# EAGLE board Mk3 v3.1415926535 (EAGLE 7.5.0), part 1 of 2
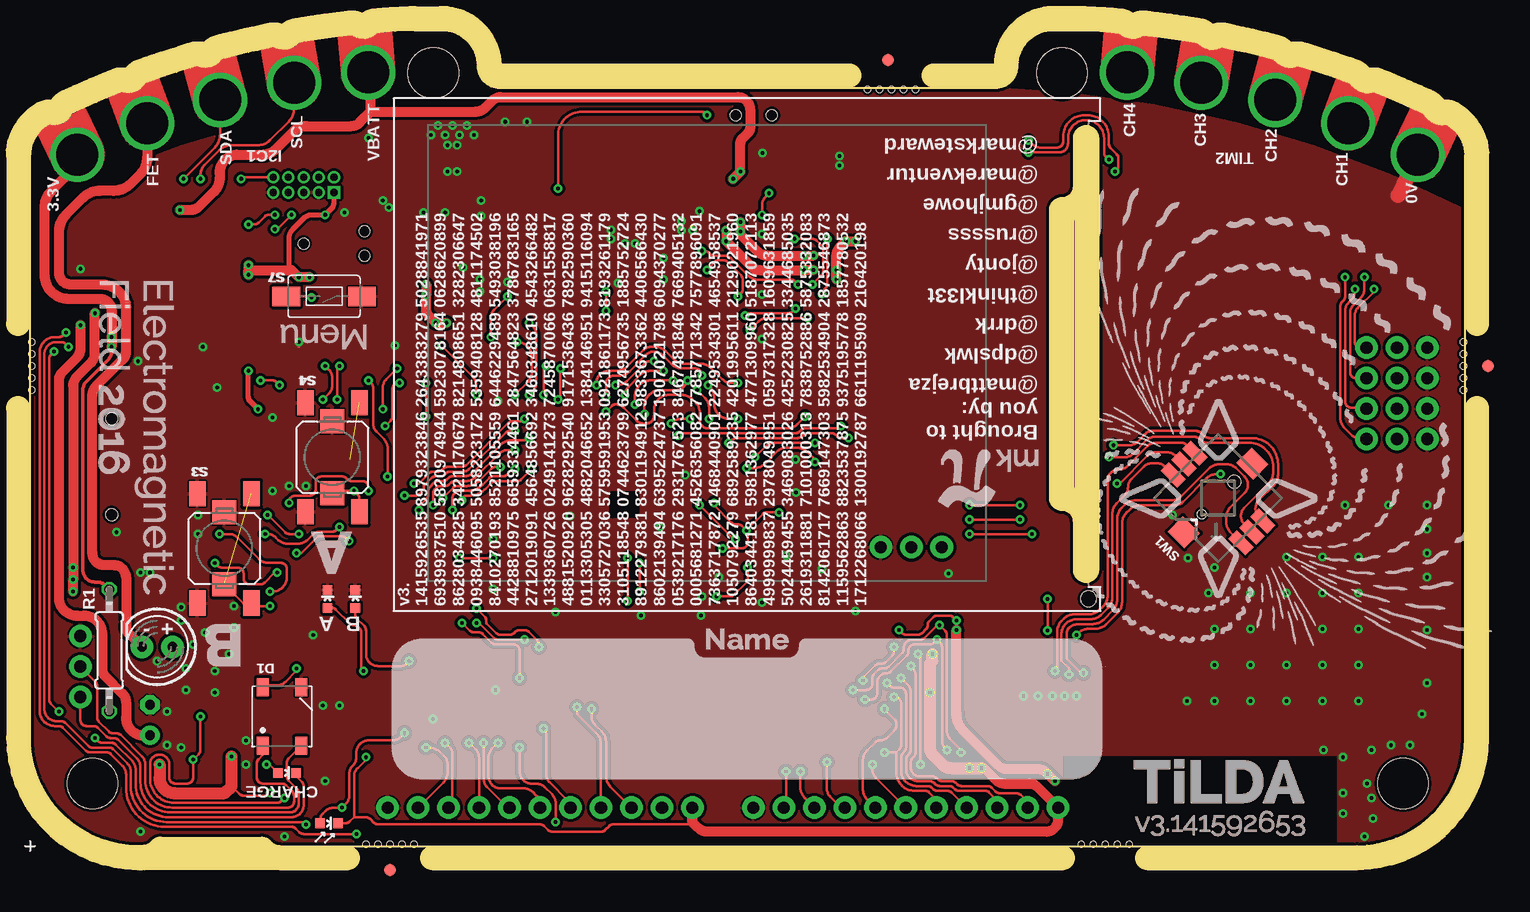
[diagram p2: board, top side]
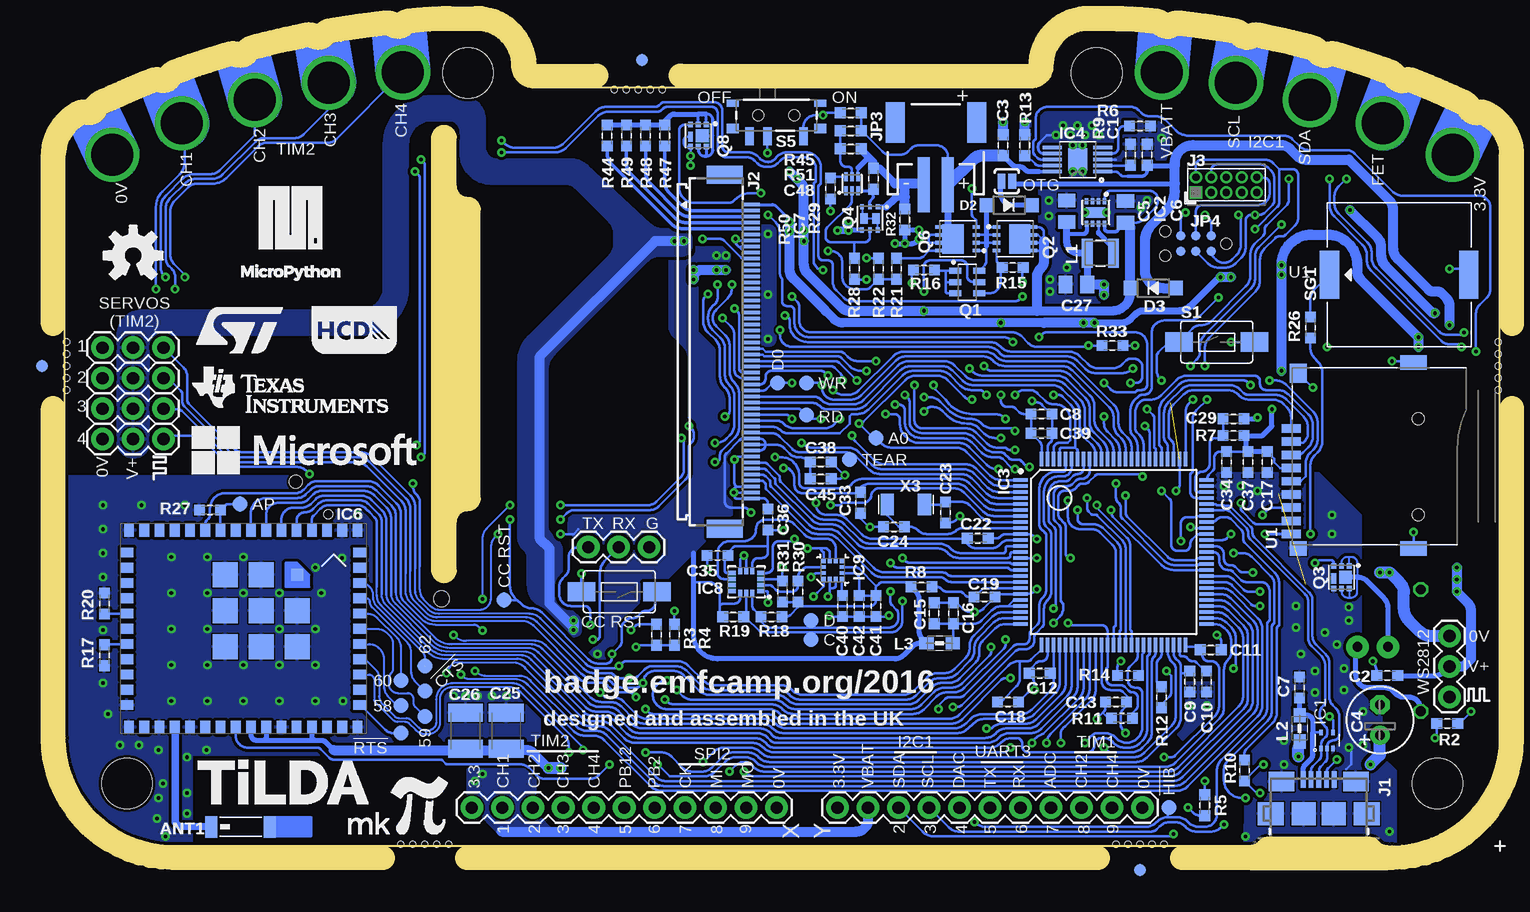
[diagram p3: board, bottom side, seen from below]

Size 119.6 x 68 mm. Coordinates in mm from the lower left corner, seen from the top.
Copper layers (1*16): Top 0.035mm / dielectric 1.4mm / Bottom 0.035mm
Design rules "TiLDA Mk3 DRC Rules": minimum track width 0.15mm, minimum drill 0.3mm, track to track 0.15mm, track to pad 0.15mm, pad to pad 0.15mm, via to via 0.15mm, smd to smd 0.05mm, copper to edge 0.2mm, drill to drill 11mil, minimum pad ring 8mil, minimum via ring 8mil, stop-mask expansion 0mil, vias tented up to drill 25mil, thermal gap 0.15mm
Net classes: 0 default: width 0.15 mm, drill 0.3 mm; 1 ANT: width 1.27 mm, drill 0.4 mm, clearance 0.4 mm; 2 90R: width 0.5 mm, drill 0.3 mm, clearance 0.7 mm to class 0, clearance 0.1 mm; 3 100R: width 0.15 mm, drill 0.3 mm, clearance 0.6 mm to class 2, clearance 0.4 mm; 4 5V0: width 0.406 mm, drill 0.3 mm, clearance 0.6 mm to class 2, clearance 0.6 mm to class 3; 5 3V3: width 0.254 mm, drill 0.3 mm, clearance 0.6 mm to class 2, clearance 0.6 mm to class 3; 6 1V8: width 0.254 mm, drill 0.3 mm, clearance 0.6 mm to class 2, clearance 0.6 mm to class 3; 7 H5V0: width 0.254 mm, drill 0.3 mm, clearance 0.6 mm to class 2, clearance 0.6 mm to class 3; 8 MAINS: clearance 4 mm to class 0, clearance 4 mm to class 1, clearance 4 mm to class 2, clearance 4 mm to class 3, clearance 4 mm to class 4, clearance 4 mm to class 5, clearance 4 mm to class 6, clearance 4 mm to class 7, clearance 4 mm

## Footprints (pad centres in the part's own frame; a part is rotated, then mirrored left to right if it is on the bottom)
2450AT42A100 = smd 1 x 1.8: P$1 -2.45,0; P$2 2.45,0
C0603K-SMALL = smd 0.889 x 0.889: 1 -0.875,0; 2 0.875,0
E2,5-6 = drill 0.813 pad 1.6: + -1.27,0 | drill 0.813 pad 1.6 octagon: - 1.27,0
C0805-N = smd 1.15 x 1.45: 1 -0.9,0; 2 0.9,0
C1210K = smd 1.5 x 2.9: 1 -1.5,0; 2 1.5,0
WS2812B = smd 1.5 x 1: 1 -2.45,1.6; 2 -2.45,-1.6; 3 2.45,-1.6; 4 2.45,1.6
SOD123 = smd 1.1 x 1.2: A 1.9,0; C -1.9,0
FIDUCIAL-1X2.5-STOP = smd 1 x 1: 1 0,0
DRL-5 = smd 0.3 x 0.45: 1 -0.5,-0.675; 2 0,-0.675; 3 0.5,-0.675; 4 0.5,0.675; 5 -0.5,0.675
WSON8 = smd 0.28 x 0.5: 1 -0.75,-0.95; 2 -0.25,-0.95; 3 0.25,-0.95; 4 0.75,-0.95; 5 0.75,0.95; 6 0.25,0.95; 7 -0.25,0.95; 8 -0.75,0.95 | smd 1.6 x 0.9: EP 0,0
TQFP100 = smd 0.3 x 1.2: 1 -6,-7.75; 2 -5.5,-7.75; 3 -5,-7.75; 4 -4.5,-7.75; 5 -4,-7.75; 6 -3.5,-7.75; 7 -3,-7.75; 8 -2.5,-7.75; 9 -2,-7.75; 10 -1.5,-7.75; 11 -1,-7.75; 12 -0.5,-7.75; 13 0,-7.75; 14 0.5,-7.75; 15 1,-7.75; 16 1.5,-7.75; 17 2,-7.75; 18 2.5,-7.75; 19 3,-7.75; 20 3.5,-7.75; 21 4,-7.75; 22 4.5,-7.75; 23 5,-7.75; 24 5.5,-7.75; 25 6,-7.75; 51 6,7.75; 52 5.5,7.75; 53 5,7.75; 54 4.5,7.75; 55 4,7.75; 56 3.5,7.75; 57 3,7.75; 58 2.5,7.75; 59 2,7.75; 60 1.5,7.75; 61 1,7.75; 62 0.5,7.75; 63 0,7.75; 64 -0.5,7.75; 65 -1,7.75; 66 -1.5,7.75; 67 -2,7.75; 68 -2.5,7.75; 69 -3,7.75; 70 -3.5,7.75; 71 -4,7.75; 72 -4.5,7.75; 73 -5,7.75; 74 -5.5,7.75; 75 -6,7.75 | smd 1.2 x 0.3: 26 7.75,-6; 27 7.75,-5.5; 28 7.75,-5; 29 7.75,-4.5; 30 7.75,-4; 31 7.75,-3.5; 32 7.75,-3; 33 7.75,-2.5; 34 7.75,-2; 35 7.75,-1.5; 36 7.75,-1; 37 7.75,-0.5; 38 7.75,0; 39 7.75,0.5; 40 7.75,1; 41 7.75,1.5; 42 7.75,2; 43 7.75,2.5; 44 7.75,3; 45 7.75,3.5; 46 7.75,4; 47 7.75,4.5; 48 7.75,5; 49 7.75,5.5; 50 7.75,6; 76 -7.75,6; 77 -7.75,5.5; 78 -7.75,5; 79 -7.75,4.5; 80 -7.75,4; 81 -7.75,3.5; 82 -7.75,3; 83 -7.75,2.5; 84 -7.75,2; 85 -7.75,1.5; 86 -7.75,1; 87 -7.75,0.5; 88 -7.75,0; 89 -7.75,-0.5; 90 -7.75,-1; 91 -7.75,-1.5; 92 -7.75,-2; 93 -7.75,-2.5; 94 -7.75,-3; 95 -7.75,-3.5; 96 -7.75,-4; 97 -7.75,-4.5; 98 -7.75,-5; 99 -7.75,-5.5; 100 -7.75,-6
HVSSOP10 = smd 0.3 x 1.6: 1 -1,-2.1; 2 -0.5,-2.1; 3 0,-2.1; 4 0.5,-2.1; 5 1,-2.1; 6 1,2.1; 7 0.5,2.1; 8 0,2.1; 9 -0.5,2.1; 10 -1,2.1 | smd 1.88 x 1.57: EP 0,0
CC3100MOD-LWK = smd 0.81 x 1.09: 1 -9.525,-8.2; 2 -8.255,-8.2; 3 -6.985,-8.2; 4 -5.715,-8.2; 5 -4.445,-8.2; 6 -3.175,-8.2; 7 -1.905,-8.2; 8 -0.635,-8.2; 9 0.635,-8.2; 10 1.905,-8.2; 11 3.175,-8.2; 12 4.445,-8.2; 13 5.715,-8.2; 14 6.985,-8.2; 15 8.255,-8.2; 16 9.525,-8.2; 28 9.525,8.2; 29 8.255,8.2; 30 6.985,8.2; 31 5.715,8.2; 32 4.445,8.2; 33 3.175,8.2; 34 1.905,8.2; 35 0.635,8.2; 36 -0.635,8.2; 37 -1.905,8.2; 38 -3.175,8.2; 39 -4.445,8.2; 40 -5.715,8.2; 41 -6.985,8.2; 42 -8.255,8.2; 43 -9.525,8.2 | smd 1.09 x 0.81: 17 9.7,-6.35; 18 9.7,-5.08; 19 9.7,-3.81; 20 9.7,-2.54; 21 9.7,-1.27; 22 9.7,0; 23 9.7,1.27; 24 9.7,2.54; 25 9.7,3.81; 26 9.7,5.08; 27 9.7,6.35; 44 -9.7,6.35; 45 -9.7,5.08; 46 -9.7,3.81; 47 -9.7,2.54; 48 -9.7,1.27; 49 -9.7,0; 50 -9.7,-1.27; 51 -9.7,-2.54; 52 -9.7,-3.81; 53 -9.7,-5.08; 54 -9.7,-6.35 | smd 1 x 1: 55 -4.5,-4.5 | smd 2.11 x 2.11: 56 -1.5,-4.5; 57 1.5,-4.5; 58 -4.5,-1.5; 59 -1.5,-1.5; 60 1.5,-1.5; 61 -4.5,1.5; 62 -1.5,1.5; 63 1.5,1.5
WSON-6 = smd 0.28 x 0.75: 1 -0.5,-0.575; 2 0,-0.575; 3 0.5,-0.575; 4 0.5,0.575; 5 0,0.575; 6 -0.5,0.575
LGA14 = smd 0.55 x 0.35: 1 -1.175,0.75; 2 -1.175,0.25; 3 -1.175,-0.25; 4 -1.175,-0.75; 8 1.175,-0.75; 9 1.175,-0.25; 10 1.175,0.25; 11 1.175,0.75 | smd 0.35 x 0.55: 5 -0.5,-0.925; 6 0,-0.925; 7 0.5,-0.925; 12 0.5,0.925; 13 0,0.925; 14 -0.5,0.925
LGA12 = smd 0.375 x 0.3: 1 -0.762,0.75; 4 -0.762,-0.75; 7 0.762,-0.75; 8 0.762,-0.25; 9 0.762,0.25; 10 0.762,0.75 | smd 0.375 x 0.35: 2 -0.762,0.25; 3 -0.762,-0.25 | smd 0.3 x 0.375: 5 -0.25,-0.762; 6 0.25,-0.762; 11 0.25,0.762; 12 -0.25,0.762
USB-AB-MICRO-SMD_LWK = smd 1.4 x 0.4: D+ 2.85,0; D- 2.85,0.65; GND 2.85,-1.3; ID 2.85,-0.65; VBUS 2.85,1.3 | smd 1.6 x 2.1: SHIELD 2.675,3.1; SHIELD@5 2.675,-3.1 | smd 1.9 x 2: SHIELD@0 0,1.25; SHIELD@1 0,-1.25 | smd 1.9 x 2.2: SHIELD@2 0,-4; SHIELD@3 0,4
FH12-50S-0.5SH = smd 0.3 x 1.3: 1 -12.25,3.25; 2 -11.75,3.25; 3 -11.25,3.25; 4 -10.75,3.25; 5 -10.25,3.25; 6 -9.75,3.25; 7 -9.25,3.25; 8 -8.75,3.25; 9 -8.25,3.25; 10 -7.75,3.25; 11 -7.25,3.25; 12 -6.75,3.25; 13 -6.25,3.25; 14 -5.75,3.25; 15 -5.25,3.25; 16 -4.75,3.25; 17 -4.25,3.25; 18 -3.75,3.25; 19 -3.25,3.25; 20 -2.75,3.25; 21 -2.25,3.25; 22 -1.75,3.25; 23 -1.25,3.25; 24 -0.75,3.25; 25 -0.25,3.25; 26 0.25,3.25; 27 0.75,3.25; 28 1.25,3.25; 29 1.75,3.25; 30 2.25,3.25; 31 2.75,3.25; 32 3.25,3.25; 33 3.75,3.25; 34 4.25,3.25; 35 4.75,3.25; 36 5.25,3.25; 37 5.75,3.25; 38 6.25,3.25; 39 6.75,3.25; 40 7.25,3.25; 41 7.75,3.25; 42 8.25,3.25; 43 8.75,3.25; 44 9.25,3.25; 45 9.75,3.25; 46 10.25,3.25; 47 10.75,3.25; 48 11.25,3.25; 49 11.75,3.25; 50 12.25,3.25 | smd 1.5 x 3: 51 -14.75,1; 52 14.75,1
PINHEAD_2X05_127 = drill 0.6 pad 1.016 square: 1 -2.54,-0.635 | drill 0.6 pad 1.016: 2 -2.54,0.635; 3 -1.27,-0.635; 4 -1.27,0.635; 5 0,-0.635; 6 0,0.635; 7 1.27,-0.635; 8 1.27,0.635; 9 2.54,-0.635; 10 2.54,0.635
1X11 = drill 1.016 pad 1.88: 1 0,0; 2 2.54,0; 3 5.08,0; 4 7.62,0; 5 10.16,0; 6 12.7,0; 7 15.24,0; 8 17.78,0; 9 20.32,0; 10 22.86,0; 11 25.4,0
JST-2-SMD = smd 1 x 4.6: 1 -1,-3.7; 2 1,-3.7 | smd 1.6 x 3.4: NC1 -3.4,1.5; NC2 3.4,1.5
TC2030-MCP-NL = smd 0.787 x 0.787: 1 1.27,-0.635; 2 1.27,0.635; 3 2.54,-0.635; 4 2.54,0.635; 5 3.81,-0.635; 6 3.81,0.635 | hole 0.889: 0,0; 5.08,-1.016; 5.08,1.016
1008 = smd 0.9 x 2.4: 1 -1.1,0; 2 1.1,0
WUERTH-0805 = smd 1.2 x 1: 1 -1.1,0; 2 1.1,0
LED5MM = drill 0.813 pad 1.88: A -1.27,0; K 1.27,0
LED-0603-CORRECT = smd 0.8 x 0.8: A 0.75,0; C -0.75,0
TILDA_MKπ_OUTLINE = drill 3.5: 3V3 3.944,57.614; CH1 91.417,64.462; CH2 97.598,63.614; CH3 103.762,62.167; CH4 109.842,60.229; FET 9.758,60.229; GND 115.656,57.614; SCL 22.002,63.614; SDA 15.838,62.167; VBATT 28.183,64.462 | hole 4.2: 33.6,64.4; 86,64.4; 5.2,5.2; 114.4,5.2 | hole 0.5: 32,0.15; 31,0.15; 30,0.15; 29,0.15; 28,0.15; 0.15,38; 0.15,39; 0.15,40; 0.15,41; 0.15,42; 69.8,63.05; 70.8,63.05; 71.8,63.05; 72.8,63.05; 73.8,63.05; 119.45,42; 119.45,41; 119.45,40; 119.45,39; 119.45,38; 91.6,0.15; 90.6,0.15; 89.6,0.15; 88.6,0.15; 87.6,0.15
SOT26 = smd 0.5 x 1: 1 -0.95,-1; 2 0,-1; 3 0.95,-1; 4 0.95,1; 5 0,1; 6 -0.95,1
Q3A = smd 0.3 x 0.6: 1 -0.975,-1.55; 2 -0.325,-1.55; 3 0.325,-1.55; 4 0.975,-1.55; 5 0.975,1.55; 6 0.325,1.55; 7 -0.325,1.55; 8 -0.975,1.55 | smd 2.45 x 1.775: EP 0,0.375
Q2 = smd 0.4 x 0.455: 1 -0.65,-0.922; 2 0,-0.922; 3 0.65,-0.922; 4 0.65,0.922; 5 0,0.922; 6 -0.65,0.922 | smd 1.05 x 1.1: EP1 -0.325,0 | smd 0.4 x 0.85: EP2 0.65,0.1
Q2_DUAL = smd 0.3 x 0.45: 1 -0.65,-0.975; 2 0,-0.975; 3 0.65,-0.975; 4 0.65,0.975; 5 0,0.975; 6 -0.65,0.975 | smd 0.625 x 0.9: EP1 -0.488,0; EP2 0.488,0
0207/10 = drill 0.813 octagon: 1 -5.08,0; 2 5.08,0
TACTILE-SWITCH-1101NE = smd 2.3 x 1.6: P$1 -3.15,0; P$2 3.15,0
SKPMAPE010-COMBINED = smd 2 x 2: 1 -3,0; 2 3,0 | smd 2.1 x 1.4: A1 -4.55,-2.25; A2 4.55,-2.25; B1 -4.55,2.25; B2 4.55,2.25
SWITCH-SPST-SMD-A = smd 0.7 x 1.5: 1 -2.25,-1.75; 2 -0.75,-1.75; 3 2.25,-1.75 | smd 1 x 0.6: GND1 -3.65,1; GND3 3.65,1 | smd 1 x 0.8: GND2 -3.65,-1.1; GND4 3.65,-1.1 | hole 0.9: -1.5,0; 1.5,0
BUZZER-PKLCS1212E = smd 1.6 x 4: P$1 -5.8,0; P$2 5.8,0
SJ_2S-NO = smd 0.635 x 1.27: 1 -0.45,0; 2 0.45,0
1X03 = drill 1.016 pad 1.88: 1 0,0; 2 2.54,0; 3 5.08,0
JOYSTICK_MULTICOMP_NOSILK = smd 2 x 1: A -4,1.275; B 4,1.275; C -4,-1.275; COM 4,0; CTR -4,0; D 4,-1.275 | smd 2 x 1.8: NC 0,4.05; NC@0 0,-4.05 | hole 0.75: 0,1.9 | hole 1.05: 0,-1.9
B1,27 = smd 1.27 x 1.27: TP 0,0
0011XAAX09X = smd 1.6 x 0.7: 1 -10.6,-0.8; 2 -10.6,-1.9; 3 -10.6,-3; 4 -10.6,-4.1; 5 -10.6,-5.2; 6 -10.6,-6.3; 7 -10.6,-7.4; 8 -10.6,-8.5; CD -10.6,-9.6 | smd 1.4 x 1.2: GND -10,-10.8 | smd 1.4 x 1.6: GND1 -10,3.8 | smd 2.2 x 1.2: GND2 -0.4,-10.8; GND3 -0.4,4.7 | hole 1: 0,0; 0,-8
ER-TFT024-3 = hole 1.3: 1,1
RESONATOR_EPSON_FC_145 = smd 1.1 x 1.8: P$1 -1.55,0; P$2 1.55,0

## Placement (x,y rotation side)
ANT1  2450AT42A100E  [2450AT42A100]  104.95,1.6 0 bottom
ARTWORK1  ARTWORK_MKπ_BACK  [TILDA_MKπ_ARTWORK_BACK]  0,0 0 bottom
ARTWORK2  ARTWORK_MKπ_FRONT  [TILDA_MKπ_ARTWORK_FRONT]  0,0 0 top
C1  0603/2u2/10V/X5R  [C0603K-SMALL]  29.4,57.6 270 bottom
C2  0603/1u/10V/X5R  [C0603K-SMALL]  9.4,14.2 0 bottom
C3  0603/2u2/10V/X5R  [C0603K-SMALL]  41.4,58.4 270 bottom
C4  DNP (OTG)  [E2,5-6]  10,10.5 90 bottom
C5  0805/10u/10V/X5R  [C0805-N]  36.1,52.9 90 bottom
C6  0805/10u/10V/X5R  [C0805-N]  31.2,52.85 90 bottom
C7  0603/100n/10V/X5R  [C0603K-SMALL]  16.7,13.2 270 bottom
C8  0603/4u7/10V/X5R  [C0603K-SMALL]  38.2,36 180 bottom
C9  DNP  [C0603K-SMALL]  25.85,13.7 90 bottom
C10  0603/0R  [C0603K-SMALL]  24.45,13.7 90 bottom
C11  0603/100n/10V/X5R  [C0603K-SMALL]  24.1,16.35 180 bottom
C12  0603/100n/10V/X5R  [C0603K-SMALL]  38.35,14.4 0 bottom
C13  0603/1u/10V/X5R  [C0603K-SMALL]  32,12 0 bottom
C15  0603/10n/25V/X7R  [C0603K-SMALL]  47.15,19.4 270 bottom
C16  0603/100n/10V/X5R  [C0603K-SMALL]  45.55,19.4 270 bottom
C17  0603/4u7/10V/X5R  [C0603K-SMALL]  19.4,32 90 bottom
C18  0603/1u/10V/X5R  [C0603K-SMALL]  41,12 180 bottom
C19  0603/0R  [C0603K-SMALL]  42.95,20.75 180 bottom
C22  0603/100n/10V/X5R  [C0603K-SMALL]  43.51,25.65 180 bottom
C23  0603/10p/50V/NP0  [C0603K-SMALL]  46.2,27.8 90 bottom
C24  0603/10p/50V/NP0  [C0603K-SMALL]  50.5,26.6 0 bottom
C25  1210/100u/20%  [C1210K]  82.8,9.6 90 bottom
C26  1210/100u/20%  [C1210K]  86.2,9.6 90 bottom
C27  0805/10u/10V/X5R  [C0805-N]  35.3,46.8 180 bottom
C29  0603/100n/10V/X5R  [C0603K-SMALL]  22.2,35.6 180 bottom
C33  0603/1u/10V/X5R  [C0603K-SMALL]  53.3,28.6 90 bottom
C34  0603/100n/10V/X5R  [C0603K-SMALL]  22.8,32 90 bottom
C35  0603/100n/10V/X5R  [C0603K-SMALL]  65.2,24.2 180 bottom
C36  0603/100n/10V/X5R  [C0603K-SMALL]  61,27.2 90 bottom
C37  0603/4u7/10V/X5R  [C0603K-SMALL]  21,32 90 bottom
C38  0603/4u7/10V/X5R  [C0603K-SMALL]  56.6,32 180 bottom
C39  0603/100n/10V/X5R  [C0603K-SMALL]  38.2,34.4 180 bottom
C40  0603/100n/10V/X5R  [C0603K-SMALL]  54.8,20 270 bottom
C41  0603/100n/10V/X5R  [C0603K-SMALL]  52,20 270 bottom
C42  0603/1u/10V/X5R  [C0603K-SMALL]  53.4,20 270 bottom
C45  0603/100n/10V/X5R  [C0603K-SMALL]  56.6,30.6 180 bottom
C48  DNP (0603/100n/10V/X5R)  [C0603K-SMALL]  54.1,58.1 180 bottom
D1  WS2812B  [WS2812B]  21,10.8 90 top
D2  NTS245SFT1G  [SOD123]  40.9,53.4 180 bottom
D3  NTS245SFT1G  [SOD123]  28.9,46.5 0 bottom
FID1  FIDUCIAL1X2.5-STOP  [FIDUCIAL-1X2.5-STOP]  71.5,65.5 90 top
FID2  FIDUCIAL1X2.5-STOP  [FIDUCIAL-1X2.5-STOP]  121.5,40 0 bottom
FID3  FIDUCIAL1X2.5-STOP  [FIDUCIAL-1X2.5-STOP]  30,-2 0 top
FID4  FIDUCIAL1X2.5-STOP  [FIDUCIAL-1X2.5-STOP]  30,-2 0 bottom
FID5  FIDUCIAL1X2.5-STOP  [FIDUCIAL-1X2.5-STOP]  121.5,40 0 top
FID6  FIDUCIAL1X2.5-STOP  [FIDUCIAL-1X2.5-STOP]  71.5,65.5 90 bottom
IC1  TPD3E001DRL  [DRL-5]  14.4,8.8 0 bottom
IC2  TPS62082  [WSON8]  33.7,52.8 180 bottom
IC3  STM32L475VG  [TQFP100]  32.2,24.5 270 bottom
IC4  BQ24092  [HVSSOP10]  35.2,57.2 90 bottom
IC6  CC3100MOD  [CC3100MOD-LWK]  104.72,18.1 180 bottom
IC7  DNP (BQ2970)  [WSON-6]  54,55.2 0 bottom
IC8  LSM6DS3  [LGA14]  62.8,22 180 bottom
IC9  LIS3MDL  [LGA12]  55.6,23 90 bottom
J1  ZX62-AB-5PA(11)  [USB-AB-MICRO-SMD_LWK]  15.1,2.7 90 bottom
J2  ER-CON50HT-1  [FH12-50S-0.5SH]  65.6,41.2 270 bottom
J3  2x5 1.27mm (NP)  [PINHEAD_2X05_127]  22.8,55.1 0 bottom
JP1  (NP)  [1X11]  85.68,3.2 0 bottom
JP2  (NP)  [1X11]  55.2,3.2 0 bottom
JP3  JST PH 2mm  [JST-2-SMD]  47,58.8 0 bottom
JP4  (NP)  [TC2030-MCP-NL]  22.8,50.2 180 bottom
L1  SRN2512-2R2M  [1008]  33.3,49.4 180 bottom
L2  BLM18KG121TN1D  [WUERTH-0805]  16.7,9.8 270 bottom
L3  BLM18KG121TN1D  [WUERTH-0805]  46.7,16.9 0 bottom
LED1  DNP  [LED5MM]  10.6,16.6 180 top
LED2  0603 RED  [LED-0603-CORRECT]  24.8,20.6 270 top
LED3  0603 GREEN  [LED-0603-CORRECT]  27.1,20.6 270 top
LED4  0603 RED  [LED-0603-CORRECT]  24.9,1.9 180 top
LED5  0603 RED  [LED-0603-CORRECT]  21.4,6.1 180 top
LOGO1  OSHW-LOGOM (NP)  [OSHW-LOGO-M]  113.9,49.2 0 bottom
LOGO2  LOGO_TI-4MM (NP)  [LOGO_TI_4MM]  109,36 0 bottom
LOGO3  LOGO_ST-4MM (NP)  [LOGO_ST_4MM]  109,41 0 bottom
LOGO4  LOGO_HCD-4MM (NP)  [LOGO_HDC_4MM]  99,41 0 bottom
LOGO5  LOGO_MICROSOFT-4MM (NP)  [LOGO_MS_4MM]  109,31 0 bottom
LOGO6  LOGO_MICROPYTHON-8MM (NP)  [LOGO_MICROPYTHON_8MM]  105,47 0 bottom
OUTLINE1  TILDA_MK3 (NP)  [TILDA_MKπ_OUTLINE]  0,0 0 top
Q1  DMMT5401  [SOT26]  44.4,47 270 bottom
Q2  CSD25402Q3A  [Q3A]  40.4,50.6 270 bottom
Q3  CSD13202Q2  [Q2]  13.2,22.4 180 bottom
Q4  DNP (CSD85301Q2)  [Q2_DUAL]  52.5,52.3 180 bottom
Q6  CSD25402Q3A  [Q3A]  45.2,50.6 90 bottom
Q8  CSD13202Q2  [Q2]  66.8,59.2 180 bottom
R1  DNP  [0207/10]  6.6,16.3 90 top
R2  0603/4k7/5%  [C0603K-SMALL]  4.4,10.2 180 bottom
R3  0603/220k/5%  [C0603K-SMALL]  70.3,17.6 270 bottom
R4  0603/220k/5%  [C0603K-SMALL]  68.8,17.6 90 bottom
R5  0603/4M7/5%  [C0603K-SMALL]  24.6,3.4 90 bottom
R6  0603/2k/5%  [C0603K-SMALL]  30,60 0 bottom
R7  0603/0R  [C0603K-SMALL]  22.2,34.2 180 bottom
R8  DNP  [C0603K-SMALL]  48.2,21.6 180 bottom
R9  0603/1k/5%  [C0603K-SMALL]  30.8,57.6 90 bottom
R10  0603/0R  [C0603K-SMALL]  21.3,6.3 270 bottom
R11  DNP  [C0603K-SMALL]  31.5,10.65 0 bottom
R12  0603/2k/5%  [C0603K-SMALL]  28.2,12.4 90 bottom
R13  0603/10k/5%  [C0603K-SMALL]  39.6,58.4 90 bottom
R14  0603/4k7/5%  [C0603K-SMALL]  31,14.2 0 bottom
R15  0603/47k/5%  [C0603K-SMALL]  40.6,48.2 0 bottom
R16  0603/10k/5%  [C0603K-SMALL]  48,48 180 bottom
R17  0603/10k/5%  [C0603K-SMALL]  116.3,15.9 270 bottom
R18  0603/4k7/5%  [C0603K-SMALL]  60.7,19.1 180 bottom
R19  0603/4k7/5%  [C0603K-SMALL]  63.9,19.1 0 bottom
R20  0603/220k/5%  [C0603K-SMALL]  116.3,20.2 90 bottom
R21  0603/470k/5%  [C0603K-SMALL]  50.3,48.1 90 bottom
R22  0603/470k/5%  [C0603K-SMALL]  51.8,48.1 90 bottom
R26  0603/120R/5%  [C0603K-SMALL]  15.8,43.2 270 bottom
R27  0603/220k/5%  [C0603K-SMALL]  107.5,28 180 bottom
R28  DNP (0603/4M7/5%)  [C0603K-SMALL]  53.8,48.1 270 bottom
R29  DNP (0603/4M7/5%)  [C0603K-SMALL]  52.2,55.6 90 bottom
R30  DNP (0603/10k/5%)  [C0603K-SMALL]  58.5,21.2 90 bottom
R31  DNP (0603/10k/5%)  [C0603K-SMALL]  59.8,21.2 90 bottom
R32  0603/0R  [C0603K-SMALL]  49.6,52.2 90 bottom
R33  0603/47k/5%  [C0603K-SMALL]  32.3,41.7 180 bottom
R44  0603/12R/5%  [C0603K-SMALL]  74.4,59.2 270 bottom
R45  0603/220k/5%  [C0603K-SMALL]  54.1,61.1 180 bottom
R47  0603/12R/5%  [C0603K-SMALL]  69.6,59.2 270 bottom
R48  0603/12R/5%  [C0603K-SMALL]  71.2,59.2 270 bottom
R49  0603/12R/5%  [C0603K-SMALL]  72.8,59.2 270 bottom
R50  DNP (0603/2k/5%)  [C0603K-SMALL]  55.8,54.8 270 bottom
R51  DNP (0603/330/5%)  [C0603K-SMALL]  54.1,59.6 0 bottom
S1  6x3  [TACTILE-SWITCH-1101NE]  23.6,42 0 bottom
S3  SKPMAPE010  [SKPMAPE010-COMBINED]  16.2,24.8 270 top
S4  SKPMAPE010  [SKPMAPE010-COMBINED]  25.2,32.4 270 top
S5  CUS-12TB  [SWITCH-SPST-SMD-A]  60.3,60.9 0 bottom
S7  6x3  [TACTILE-SWITCH-1101NE]  24.5,45.8 180 top
S8  DNP (6x3)  [TACTILE-SWITCH-1101NE]  73.4,21.2 180 bottom
SG1  BUZZER-PKLCS1212E  [BUZZER-PKLCS1212E]  8.4,47.6 0 bottom
SJ1  OTG (NP)  [SJ_2S-NO]  41.1,55.4 0 bottom
SV2  (NP)  [1X03]  4.2,17.5 270 bottom
SV3  (NP)  [1X03]  116.45,41.53 0 bottom
SV4  (NP)  [1X03]  116.45,33.91 0 bottom
SV5  (NP)  [1X03]  116.45,38.99 0 bottom
SV6  (NP)  [1X03]  116.45,36.45 0 bottom
SV7  (NP)  [1X03]  70.9,24.9 180 bottom
SW1  JOYSTICK  [JOYSTICK_MULTICOMP_NOSILK]  99,29 135 top
TP1  (NP)  [B1,27]  60.2,38.6 0 bottom
TP2  (NP)  [B1,27]  57.8,35.9 0 bottom
TP3  (NP)  [B1,27]  57.8,38.6 0 bottom
TP4  (NP)  [B1,27]  52,34 0 bottom
TP5  (NP)  [B1,27]  27.6,3.2 0 bottom
TP11  (NP)  [B1,27]  105,28.5 0 bottom
TP12  (NP)  [B1,27]  89.6,12.9 0 bottom
TP13  (NP)  [B1,27]  91.6,9.4 0 bottom
TP14  (NP)  [B1,27]  91.6,11.7 0 bottom
TP15  (NP)  [B1,27]  89.6,10.8 0 bottom
TP16  (NP)  [B1,27]  91.6,13.8 0 bottom
TP17  (NP)  [B1,27]  89.6,15 0 bottom
TP18  (NP)  [B1,27]  57.4,18.8 0 bottom
TP19  (NP)  [B1,27]  57.4,17.2 0 bottom
TP20  (NP)  [B1,27]  83,20.5 0 bottom
TP21  (NP)  [B1,27]  54.2,32.2 0 bottom
U1  USD-SOCKET  [0011XAAX09X]  6.8,35.6 0 bottom
U2  ER-TFT024-3 (NP)  [ER-TFT024-3]  89.2,19.6 90 top
X3  ABS07-32.768KHZ-T  [RESONATOR_EPSON_FC_145]  49.5,28.45 180 bottom

## Tracks (layer width: path | path; a pad name or v marks a point on that pad's centre or on a via)
!CC_HIB  (via drill 0.3)
  Top 0.2: v43.8,2 43.8,3.59 arc45 43.51,4.29 42.89,4.91 arc45 42.19,5.2 41.8,5.2 arc-90 40.8,6.2 v40.8,8.2
  Bottom 0.15: 81.03,15.23 arc-45 81.93,15.6 87.97,15.6 arc45 89.39,16.19 93.23,20.03 arc45 93.6,20.93 93.6,21.6
  Bottom 0.2: v40.8,8.2 41.05,7.95 arc45 41.41,7.8 60.47,7.8 arc45 61.37,8.17 61.43,8.23 arc-45 62.33,8.6 72.07,8.6 arc45 72.97,8.97 74.03,10.03 arc-45 74.93,10.4 75.67,10.4 arc45 76.57,10.77 81.03,15.23 | IC3.63 23.9,24.5 arc90 23.4,24 23.4,23.75 arc-90 22.65,23 22.61,23 arc45 22.25,22.85 21.55,22.15 arc-45 21.19,22 19.95,22 arc90 19.2,21.25 19.2,18.88 arc45 19.26,18.74 19.34,18.66 arc-45 19.4,18.52 19.4,11.53 arc45 19.77,10.63 23.23,7.17 arc-45 23.6,6.27 23.6,2.6 arc90 24.6,1.6 25.07,1.6 arc45 25.97,1.97 26.03,2.03 arc-45 26.93,2.4 27.67,2.4 | 27.67,2.4 arc-45 28.57,2.03 28.63,1.97 arc45 29.53,1.6 42.87,1.6 arc45 43.77,1.97 v43.8,2 | 93.6,21.6 93.6,26.92 arc-45 93.8,27.4 94.2,27.8 | 94.2,27.8 | 94.2,27.8 94.52,28.12 arc-45 95.2,28.4 97.59,28.4 arc-45 98.29,28.11 98.86,27.54 arc-45 99.01,27.18 IC6.4 | 94.2,27.8 | TP5.TP 27.67,3.2 27.67,2.4
!CC_RST  (via drill 0.3)
  Top 0.2: v74.2,6.8 74.2,15.59 arc45 74.05,15.95 v74,16 | v54,34.2 54.2,34.4 63.79,34.4 arc45 64.15,34.55 64.25,34.65 arc-45 64.61,34.8 67.19,34.8 arc45 67.55,34.95 v67.6,35 | v78.3,27.2 v82.5,27.2
  Bottom 0.2: IC6.35 105.36,9.2 arc-90 104.36,8.2 98.61,8.2 arc45 98.25,8.05 97.55,7.35 arc-45 97.19,7.2 88.28,7.2 arc45 88.14,7.14 87.86,6.86 arc-45 87.72,6.8 81.61,6.8 arc45 80.91,6.51 80.29,5.89 arc-45 79.59,5.6 75.81,5.6 arc-45 75.11,5.89 v74.2,6.8 | v67.6,35 67.35,34.75 arc45 67.2,34.39 67.2,34.01 arc45 67.35,33.65 67.45,33.55 arc-45 67.6,33.19 67.6,31.21 arc45 67.89,30.51 70.11,28.29 arc45 70.81,28 77.09,28 arc-45 77.79,27.71 v78.3,27.2 | IC3.2 41.67,30 arc45 42.57,30.37 43.63,31.43 arc-45 44.53,31.8 51.27,31.8 arc45 52.17,32.17 53.72,33.72 arc45 v54,34.2 | S8.P$1 70.4,21.05 70.4,20.21 arc45 70.55,19.85 70.65,19.75 arc45 71.01,19.6 71.19,19.6 arc-45 71.55,19.45 71.85,19.15 arc45 72.21,19 72.39,19 arc-45 72.75,18.85 73.05,18.55 arc-45 73.2,18.19 73.2,17.01 arc45 73.35,16.65 v74,16 74,15.7 arc90 74.5,15.2 75.07,15.2 arc45 75.97,15.57 79.86,19.46 arc-45 80.67,19.8 arc45 81.57,20.17 81.9,20.5 | 81.9,20.5 82.13,20.73 arc45 82.5,21.63 v82.5,27.2 | TP20.TP 81.9,20.5
!UART_CTS
  Bottom 0.15: 94.64,20.64 94.44,20.64 arc90 94.2,20.4 arc-45 93.99,19.89 91.12,17.02 arc45 90.75,16.12 90.75,14.58 arc-45 90.38,13.68 TP12.TP
  Bottom 0.2: IC6.51 94.64,20.64
!UART_RTS
  Bottom 0.2: IC6.44 94.95,11.75 92.89,9.69 arc-45 92.19,9.4 TP13.TP
+3V3  (via drill 0.3)
  Top 0.2: v41.6,37.6 41.91,37.91 arc45 42.2,38.61 42.2,42.59 arc45 41.91,43.29 v41.6,43.6 | 27,2.4 27,5.79 arc-45 27.29,6.49 28,7.2 v28,7.4 | 27,2.4 26.65,2.05 arc-45 26.29,1.9 LED4.C | 55.2,2.2 54.8,1.8 48.61,1.8 arc45 48.25,1.65 47.95,1.35 arc-45 47.59,1.2 43.51,1.2 arc-45 43.15,1.35 42.85,1.65 arc45 42.49,1.8 29.01,1.8 arc-45 28.65,1.95 28.35,2.25 arc45 27.99,2.4 27,2.4 | v57,28.6 57,28.4 58.45,26.95 arc45 58.81,26.8 58.99,26.8 arc-45 59.35,26.65 v59.7,26.3 | v62.4,27.8 61.41,27.8 arc45 61.05,27.65 v59.7,26.3 | v57.7,24.8 59.3,24.8 arc90 59.8,25.3 59.8,26.2 v59.7,26.3 | SW1.COM 95.49,32.51 arc45 94.79,32.8 93.81,32.8 arc45 93.11,32.51 90.8,30.2 v90.6,30.2 | v83.5,26 v78.3,26
  Top 0.305: v6.8,41.6 6.8,41.21 arc-45 6.51,40.51 4.69,38.69 arc45 4.4,37.99 4.4,23 arc90 5.4,22 5.61,22 arc-45 6.24,21.74 R1.2
  Top 0.406: J3.1 25.3,54.42 25.3,53.51 arc-45 25.15,53.15 v24.6,52.6 23.51,52.6 arc45 22.81,52.31 21.89,51.39 arc45 21.6,50.69 21.6,48 | v19,36.4 18.35,37.05 arc-45 18.2,37.41 v18.2,39.6
  Top 0.813: v65.3,49.2 61.41,49.2 arc-45 60.71,49.49 59.2,51 v59.2,51.2 v59.2,52 | v33,46.8 v33,45.9 33,44.81 arc45 33.29,44.11 v33.8,43.6 v34.7,43.6 | v18.2,47.6 18.2,48 | v79.3,6.5 79.5,6.5 80.51,5.49 arc45 81.21,5.2 83.27,5.2 arc-45 83.97,4.91 JP1.1 85.68,2.2 arc-90 84.68,1.2 56.41,1.2 arc-45 55.71,1.49 55.2,2 55.2,2.2 JP2.1 | OUTLINE1.3V3 3.94,56.57 3.77,56.57 1.79,54.59 arc45 1.2,53.17 1.2,47.6 arc90 3.2,45.6 5.8,45.6 arc-90 6.8,44.6 v6.8,42.4 v6.8,41.6 | v18.2,48.4 18.2,48 | 18.2,48 21.6,48 21.8,48 v22.4,47.4 v23.3,47.4
  Top 1: v75,12.8 75,15.2 75.2,15.4 v75.2,16
  Top 1.016: v75,12.8 75,8.21 arc45 75.29,7.51 76.01,6.79 arc45 76.71,6.5 v78.3,6.5 v79.3,6.5
  Bottom 0.15: v83.5,26 83.73,25.77 arc-45 84.1,24.87 84.1,20.65 arc90 85.1,19.65 88.27,19.65 arc45 89.17,20.02 89.63,20.48 arc45 90,21.38 90,23.33
  Bottom 0.2: v41.6,43.6 38,43.6 | 20.93,32.88 C37.2 C34.2 23.3,32.88 arc-90 23.8,32.38 23.8,31.61 arc45 23.95,31.25 24.25,30.95 arc-45 24.4,30.59 24.4,30.55 IC3.75 | v75,12.8 74.6,12.4 73.93,12.4 arc45 73.03,12.03 71.97,10.97 arc-45 71.07,10.6 61.33,10.6 arc45 60.43,10.23 60.37,10.17 arc-45 59.47,9.8 45.55,9.8 arc-45 44.49,10.24 44.16,10.56 arc45 43.1,11 39.93,11 arc-45 39.03,11.37 37.57,12.83 arc-45 37.2,13.73 37.2,14.4 | IC3.11 40.89,25.5 arc-45 41.59,25.21 41.71,25.09 arc45 42.41,24.8 43.59,24.8 arc45 44.29,25.09 44.4,25.2 44.4,25.64 C22.2 44.45,25.65 44.5,25.6 52.27,25.6 arc45 53.17,25.97 54.43,27.23 arc-45 55.33,27.6 56.12,27.6 arc45 56.8,27.9 arc45 57,28.52 v57,28.6 | IC3.100 38.2,33.32 arc-45 38.35,33.67 C39.2 C8.2 39.69,36 arc45 40.05,36.15 40.35,36.45 arc-45 40.71,36.6 41.1,36.6 arc90 41.6,37.1 v41.6,37.6 | v28,7.4 27.41,7.4 arc-45 27.05,7.55 23.77,10.83 arc-45 23.4,11.73 23.4,14.72 arc-45 23.6,15.2 23.65,15.25 arc-45 24.01,15.4 24.3,15.4 arc90 24.8,15.9 24.8,16.18 C11.2 25.15,16.35 25.4,16.6 26.05,16.6 IC3.50 | 61.2,33.45 arc-90 61.7,33.95 J2.40 63.04,33.95 arc-45 63.4,33.8 64.45,32.75 arc-45 64.6,32.39 64.6,28.7 arc-90 64.1,28.2 63.01,28.2 arc45 62.65,28.05 v62.4,27.8 | J2.42 61.7,32.95 arc-90 61.2,33.45 | J2.41 61.2,33.45 | JP4.1 24.07,51.86 arc-45 24.22,52.22 v24.6,52.6 | 61.2,33.45 60.36,33.45 arc45 59.66,33.16 59.19,32.69 arc-45 58.49,32.4 58.41,32.4 arc45 57.71,32.11 57.6,32 C38.2 C45.2 | IC9.9 55.85,24.47 arc-45 55.91,24.61 56.04,24.74 arc-45 56.18,24.8 56.7,24.8 | IC9.10 56.35,24.41 arc-45 56.38,24.48 56.7,24.8
  Bottom 0.2: 56.7,24.8 v57.7,24.8 | IC8.5 62.3,23.5 arc90 61.8,24 61.5,24 arc-90 61,24.5 61,25 | IC8.8 64.4,22.75 arc90 64.6,22.95 64.6,23.93 C35.1 64.33,24.48 63.95,24.85 arc45 63.59,25 61,25 | IC8.12 63.3,20.7 arc90 63.8,20.2 64.72,20.2 arc-45 64.86,20.14 65,20 | R19.1 65,19.1 65,20 | R8.2 49.2,21.6 49.6,22 51.39,22 arc-45 51.75,21.85 52,21.6 | 52,21.6 C41.1 | C41.1 52,20.5 arc90 52.5,20 58.17,20 R30.1 | R18.1 59.51,19.1 arc-45 59.15,19.25 58.5,19.9 R30.1 | 90,23.33 90,28.59 arc-45 90.29,29.29 90.31,29.31 arc45 90.6,30.01 v90.6,30.2 | v78.3,26 77.2,26 76.8,26.4 | U1.4 18.3,31.5 18.8,32 18.8,32.27 C17.2 | IC3.28 37.2,14.4 | C12.2 37.2,14.4 | 65,20 65,21 arc-90 66,22 67.2,22 | R31.1 R30.1 | 61,25 C36.1 61,26.3 v59.7,26.3 | IC9.5 53.9,22.75 arc90 53.4,22.25 C42.1 C41.1 | IC9.6 53.76,23.25 arc45 53.4,23.1 52,21.7 52,21.6 | C26.1 86.2,8 | C25.1 82.9,8.1 82.9,8
  Bottom 0.254: J2.1 60.66,53.45 arc45 60.3,53.3 59.35,52.35 arc45 v59.2,51.99
  Bottom 0.305: C37.2 21.05,32.88 21.12,32.95
  Bottom 0.341: IC2.5 34.45,51.25 arc90 34.7,51 36.1,51
  Bottom 0.406: IC6.36 104.09,9.3 arc-90 103.59,8.8 102.98,8.8 | 102.98,8.8 98.78,8.8 | 98.78,8.8 98.21,8.8 arc45 97.85,8.65 97.2,8 | IC6.37 102.82,8.96 102.98,8.8 | IC6.40 99.01,9.03 98.78,8.8 | 21.12,32.95 21.12,34 R7.1 19.8,34.2 19,35 v19,36.4 | R8.2 48.69,21.22 arc45 48.4,20.51 48.4,17.91 arc-45 48.11,17.21 L3.1 48.29,16.9 arc-45 48.99,16.61 49.71,15.89 arc45 50.41,15.6 65.2,15.6 arc90 67.2,17.6 67.2,22 67.2,24.4 | C17.2 C37.2
  Bottom 0.6: v33.8,43.6 31.51,43.6 arc-45 30.81,43.89 30.39,44.31 arc45 29.69,44.6 26.82,44.6 arc-45 25.76,45.04 23.4,47.4 v23.3,47.4 | C5.1 36.1,51 36.1,50.4 arc-90 35.1,49.4 L1.2 C27.1
  Bottom 0.75: 38,43.6 54.79,43.6 arc45 55.49,43.89 56.2,44.6
  Bottom 0.813: v33.8,43.6 v34.7,43.6 38,43.6 | 56.2,44.6 58.91,47.31 arc45 59.2,48.01 v59.2,51.2 v59.2,51.99 | 97.2,8 86.2,8 82.9,8 81.21,8 arc45 80.51,7.71 v79.3,6.5 | C27.1 v33,46.8 v33,45.9 | v22.4,47.4 v23.3,47.4 | v18.2,39.6 v18.2,47.6 v18.2,48.4 18.2,48.45 arc90 15.7,50.95 14.4,50.95 arc90 11.9,48.45 11.9,47.87 arc-45 11.64,47.24 v6.8,42.4 v6.8,41.6
  Bottom 1.016: v78.3,6.5 v79.3,6.5
  other vias: 64.5,49.2
  pour Bottom (isolate 0.254, rank 2): 66.9,48.5 64.7,48.5 arc-90 64.2,49 64.2,49.4 arc-90 64.7,49.9 68,49.9 arc-90 69.2,48.7 69.2,43.33 arc-45 68.83,42.43 67.97,41.57 arc45 67.6,40.67 67.6,34 68,33.6 68,30.8 70.4,28.4 70.4,28 77.2,28 77.6,27.6 77.6,26.2 77.1,25.7 74.7,25.7 74.7,17.3 76,16 76,15.9 75.6,15.4 74.7,15.4 73.2,16.4 73.2,18.8 70.4,21.6 70,21.6 64,27.6 64.4,40.4 66.9,42.9
ADC_IN  (via drill 0.3)
  Top 0.2: JP2.8 37.42,7.37 arc45 37.13,8.07 v36.6,8.6
  Bottom 0.2: v36.6,8.6 36.6,9.47 arc45 36.23,9.97 34.07,12.13 arc-45 33.7,13.03 IC3.35
ADC_LIGHT  (via drill 0.3)
  Top 0.2: v31.2,9.4 30.89,9.09 arc-45 30.19,8.8 28.2,8.8 arc90 27.2,7.8 27.2,7.41 arc-45 26.91,6.71 26.89,6.69 arc45 26.6,5.99 26.6,4.21 arc-45 26.31,3.51 v26,3.2 25.31,3.2 arc45 24.61,2.91 24.44,2.74 arc45 24.15,2.04 LED4.A
  Bottom 0.2: IC3.36 33.2,13.75 arc-90 32.45,13 31.81,13 arc45 31.45,12.85 30.9,12.3 31.12,12.07 C13.2 31.2,11.93 31.2,11.6 31.45,11.35 arc-45 31.6,10.99 31.6,10.08 | v31.2,9.4 arc45 31.46,9.74 arc45 31.6,10.08 | 31.6,10 31.6,10.08 | R5.1 24.91,2.52 arc45 25.62,2.82 v26,3.2
ADC_VIN  (via drill 0.3)
  Top 0.2: v69.4,13.8 arc-45 69.54,14.14 70.45,15.05 arc-45 70.81,15.2 70.99,15.2 arc45 71.35,15.35 71.85,15.85 arc45 72,16.21 v72,16.6
  Bottom 0.2: IC3.26 38.2,16.4 39.05,15.55 arc45 39.41,15.4 40,15.4 | 40,15.4 40.07,15.4 arc-45 40.97,15.03 45.03,10.97 arc45 45.93,10.6 59.07,10.6 arc45 59.97,10.97 60.03,11.03 arc-45 60.93,11.4 69.4,11.4 arc90 70.6,12.6 arc90 v69.4,13.8 | 40,15.4 40,14.01 arc45 40.29,13.31 41.41,12.19 arc45 C18.2 | R4.1 R3.2 71.88,16.73 v72,16.6
ADC_X
  Bottom 0.2: J2.46 61.56,30.95 arc45 61.2,30.8 60.86,30.46 arc45 60.8,30.32 60.8,30.08 arc-45 60.74,29.94 57.57,26.77 arc-45 56.67,26.4 55.93,26.4 arc45 55.03,26.03 52.17,23.17 arc-45 51.27,22.8 46.48,22.8 arc45 46,22.6 arc-45 45.76,22.5 IC3.17
ADC_Y
  Bottom 0.2: J2.47 61.53,30.45 arc45 61.39,30.39 61.26,30.26 arc45 61.2,30.12 61.2,29.88 arc-45 61.14,29.74 57.77,26.37 arc-45 56.87,26 56.13,26 arc45 55.23,25.63 52.37,22.77 arc-45 51.47,22.4 46.68,22.4 arc45 46.2,22.2 arc-45 45.72,22 IC3.18
BAT
  Bottom 0.2: IC7.5 54,56.3 arc-90 54.3,56.6 54.48,56.6 arc90 54.98,57.1 C48.2 R51.1
BOOT0/JOY_CEN  (via drill 0.3)
  Top 0.2: v37.2,37.6 37.2,38.39 arc45 36.91,39.09 v34.3,41.7 | v89.9,57.2 89.62,57.48 arc-45 89.5,57.77 89.5,59 arc90 88,60.5 arc90 86.5,59 86.5,58.55 arc-90 85.75,57.8 v83.2,57.8 | v56.4,48 57.05,48.65 arc-45 57.41,48.8 57.79,48.8 arc-45 58.15,48.65 59.25,47.55 arc-45 59.4,47.19 59.4,46.41 arc-45 59.25,46.05 v59,45.8 | v89.9,32.4 91.21,32.4 arc45 91.92,32.69 93.03,33.81 arc-45 93.74,34.1 97.01,34.1 arc-45 97.5,33.9 97.59,33.8 arc45 98.09,33.6 101.6,33.6 arc-90 103.6,31.6 103.6,31.13 arc-45 103.23,30.23 101.21,28.21 arc90 101.21,26.79 SW1.CTR
  Bottom 0.2: IC3.97 36.7,33 arc90 36.5,33.2 35.4,33.2 | IC3.94 35.2,32.92 arc-45 35.26,33.06 35.4,33.2 | 35.4,33.2 35.4,35.87 arc-45 35.77,36.77 36.45,37.45 arc-45 36.81,37.6 v37.2,37.6 | v89.9,32.4 89.72,32.58 arc-45 89.6,32.87 89.6,56.73 arc-45 89.72,57.02 v89.9,57.2 | v56.4,48 arc90 57.2,48.8 57.2,55.12 arc45 57.14,55.26 57.06,55.34 arc-45 57,55.48 57,56.4 arc-90 58,57.4 59.29,57.4 arc-45 59.99,57.11 60.21,56.89 arc45 60.91,56.6 61.19,56.6 arc45 61.89,56.89 62.11,57.11 arc-45 62.81,57.4 64.45,57.4 arc90 65.2,58.15 65.2,61.1 arc-90 65.7,61.6 69.39,61.6 arc-45 69.75,61.45 69.85,61.35 arc45 70.21,61.2 74.28,61.2 arc-45 75.17,60.83 77.83,58.17 arc45 78.72,57.8 v83.2,57.8 | v59,45.8 58.55,45.35 arc45 58.4,44.99 58.4,43.8 arc-90 57.4,42.8 40.61,42.8 arc45 39.91,42.51 39.29,41.89 arc-45 38.59,41.6 34.4,41.6 v34.3,41.7 R33.2
BTN_A  (via drill 0.3)  (1 unrouted)
  Top 0.2: S4.2 25.2,29.6 v27,29.6 27.3,29.3 arc-45 27.45,28.94 S4.B2 27.6,27.7 | 27.6,27.7 27.6,28.8 | 27.6,27.57 27.6,27.7
  Bottom 0.2: IC3.77 26.7,30.11 arc45 26.85,29.75 v27,29.6
BTN_B  (via drill 0.3)  (1 unrouted)
  Top 0.2: v20,20 18.7,20 S3.B2 17.75,20.25 S3.2
  Bottom 0.2: IC3.58 23.01,22 arc45 22.31,21.71 20.75,20.15 arc-45 20.39,20 v20,20
BTN_MENU  (via drill 0.3)
  Top 0.2: S7.P$2 23.37,45.8 v23.47,45.7
  Bottom 0.2: IC3.84 30.2,33.27 arc-45 30.57,34.17 arc45 30.8,34.72 30.8,36.27 arc45 30.43,37.17 30.15,37.45 arc45 29.79,37.6 29.7,37.6 arc-90 29,38.3 29,42.92 arc45 28.8,43.4 28.77,43.43 arc45 27.87,43.8 25.9,43.8 arc-45 25,44.17 v23.47,45.7 23.57,45.6
BUZZ  (via drill 0.3)
  Top 0.2: v15.8,26 16.59,26 arc-45 17.29,25.71 19.11,23.89 arc45 19.81,23.6 20.9,23.6 arc-90 21.4,23.1 21.4,22.4 arc-90 20.2,21.2 v20,21.2
  Bottom 0.2: v15.8,26 15.8,31.67 arc45 15.43,32.57 15.17,32.83 arc-45 14.8,33.73 14.8,39.47 arc-45 15.17,40.37 15.43,40.63 arc45 15.8,41.53 R26.2 15.8,41.4 | IC3.59 22.91,22.5 arc45 22.21,22.21 21.35,21.35 arc-45 20.99,21.2 v20,21.2
C1
  Bottom 0.2: C40.1 54.85,20.88 IC9.4
CC_IRQ  (via drill 0.3)
  Top 0.2: v84.8,17.95 v84.8,20.6 | v78.3,28.4 v82.5,28.4 | v58.2,33.6 58.31,33.71 arc-45 59.01,34 63.99,34 arc45 64.35,34.15 64.45,34.25 arc-45 64.81,34.4 66.79,34.4 arc-45 67.15,34.25 67.25,34.15 arc45 67.61,34 v68.2,34
  Bottom 0.15: v84.8,17.95 85.15,18.3 arc-45 85.51,18.45 88.72,18.45 arc45 89.77,18.82 91.23,20.28 arc45 91.6,21.03 | v82.5,28.4 84.43,26.47 arc-45 84.8,25.57 v84.8,20.6
  Bottom 0.2: v68.2,34 arc45 68,33.52 68,31.41 arc45 68.29,30.71 70.31,28.69 arc45 71.01,28.4 v78.3,28.4 | IC3.3 41.77,29.5 arc45 42.67,29.87 43.83,31.03 arc-45 44.73,31.4 51.47,31.4 arc45 52.37,31.77 53.43,32.83 arc-45 54.33,33.2 57.39,33.2 arc45 58.09,33.49 v58.2,33.6 | IC6.11 107.9,26.79 arc45 107.75,27.15 107.65,27.25 arc-45 107.5,27.61 107.5,27.78 107.5,28.13 arc90 106.23,29.4 100.41,29.4 arc-45 99.71,29.69 99.29,30.11 arc45 98.59,30.4 94.33,30.4 arc45 93.43,30.03 91.97,28.57 arc45 91.6,27.67 91.6,21.03
CC_RESERVED
  Bottom 0.2: IC6.21 116.3,19.37 R20.1
COUT
  Bottom 0.2: Q4.5 52.5,50.8 arc90 53,50.3 53.8,50.3 | IC7.2 54,53.81 arc45 54.15,53.45 56.05,51.55 arc-45 56.2,51.19 56.2,50.8 arc-90 55.7,50.3 53.8,50.3 | R28.1 53.8,50.3
D_N
  Bottom 0.2: J1.D- 15.75,6.29 arc45 15.6,6.64 15.05,7.2 arc-45 14.9,7.55 IC1.1 14.9,8.49 arc45 14.75,8.85 14.55,9.05 arc-45 14.4,9.41 14.4,9.59 arc-45 14.55,9.95 14.71,10.11 arc45 15,10.81 15,11.19 arc45 14.85,11.55 14.72,11.68 arc-45 14.57,12.03 14.57,15.11 arc-45 14.87,15.82 15.68,16.64 arc45 15.97,17.34 15.97,20.31 arc-45 16.27,21.02 20.83,25.58 arc45 20.98,25.93 20.98,26.12 arc-45 21.12,26.47 22.53,27.88 arc-45 22.88,28.02 23,28.02 23.02,28 IC3.70
D_P
  Bottom 0.2: IC3.71 23.7,28.5 23.6,28.4 23.02,28.4 23,28.38 22.73,28.38 arc45 22.38,28.23 20.77,26.62 arc45 20.62,26.27 20.62,26.08 arc-45 20.48,25.73 15.92,21.16 arc45 15.62,20.46 15.62,17.49 arc-45 15.33,16.78 14.52,15.96 arc45 14.22,15.26 14.22,12.44 arc-45 13.93,11.73 13.69,11.49 arc45 13.4,10.79 13.4,9.3 arc90 13.9,8.8 arc-90 14.4,8.3 IC1.2 14.4,7.36 arc45 14.55,7.01 14.93,6.62 arc-45 15.08,6.27 15.08,6.17 15.1,6.15 J1.D+
DAC_OUT  (via drill 0.3)
  Top 0.2: JP2.5 arc45 44.78,3.81 43.29,5.31 arc-45 43,6.01 43,9.39 arc45 42.85,9.75 v42.8,9.8
  Bottom 0.2: IC3.30 36.2,13.53 arc45 36.57,12.63 38.63,10.57 arc45 39.53,10.2 41.47,10.2 arc-45 42.37,9.83 arc45 42.44,9.8 v42.8,9.8
DFGFDG
  Bottom 0.2: IC3.22 41,20 | IC3.21 40.5,20.5 41,20 | 45.58,18.52 C16.2 43.86,18.52 arc-45 43.2,18.8 42.37,19.63 arc45 41.47,20 41,20 | C15.2 45.58,18.52 | 45.58,18.52 45.58,16.9 L3.2 45.7,16.9
DOUT
  Bottom 0.2: R29.1 52.2,54.62
  Bottom 0.254: IC7.3 52.23,54.62 | 52.2,54.62 52.23,54.62 | Q4.2 52.5,53.67 arc45 52.44,53.81 52.28,53.97 arc-45 52.23,54.11 52.23,54.62
DRDY
  Bottom 0.2: IC8.9 64.7,22.25 arc90 65.2,22.75 65.2,24.4 arc90 64.2,25.4 63,25.4 arc-90 62,26.4 arc90 61.2,27.2 59.73,27.2 arc45 58.83,26.83 57.97,25.97 arc-45 57.07,25.6 56.08,25.6 arc45 55.6,25.4 arc45 55.35,24.8 IC9.8
FET_OUT
  Top 0.813: OUTLINE1.FET 9.76,57.39 arc-45 9.17,55.97 8.39,55.19 arc-45 6.97,54.6 5.83,54.6 arc45 4.41,54.01 2.99,52.59 arc45 2.4,51.17 2.4,47.8 arc90 3.4,46.8 6,46.8 arc-90 8,44.8 8,41.21 arc-45 7.71,40.51 5.49,38.29 arc45 5.2,37.59 5.2,24.4 arc90 6.2,23.4 7,23.4 arc-90 8,22.4 8,18.34 arc45 8.29,17.64 LED1.K
  Bottom 0.15: Q3.5 13.2,21.2 arc-90 12.7,20.7 12.6,20.7 | 12.6,20.7 12.4,20.7 arc-90 11.9,21.2 11.9,22.37 11.93,22.4 11.9,22.43 11.9,23.6 arc-90 12.4,24.1 12.55,24.1 | Q3.6 12.55,20.75 12.6,20.7 | Q3.2 13.2,23.6 arc90 12.7,24.1 12.55,24.1 | Q3.1 12.55,24.1
  Bottom 0.406: LED1.K 9.33,19.8 arc-45 9.7,20.7 11.03,22.03 arc-45 11.93,22.4 Q3.EP1
FORCE_AP
  Bottom 0.2: IC6.10 R27.1 106.27,28.35 arc45 105.92,28.5 TP11.TP
FS_VUSB
  Bottom 0.2: IC3.68 24.01,27 arc-45 23.65,27.15 23.55,27.25 arc45 23.19,27.4 22.81,27.4 arc45 22.45,27.25 21.55,26.35 arc45 21.4,25.99 21.4,25.61 arc-45 21.25,25.25 18.77,22.77 arc45 18.4,21.88 18.4,18.48 arc45 18.46,18.34 18.54,18.26 arc-45 18.6,18.12 18.6,11.13 arc45 18.97,10.23 21.15,8.05 arc-45 21.3,7.69 R10.1
FSMC_A23  (via drill 0.3)
  Top 0.2: v53.4,35.2 53.43,35.23 arc-45 54.33,35.6 v55,35.6 | v44,37.2 44.2,37.4 v44.2,39.8
  Bottom 0.2: IC3.1 41.57,30.5 arc45 42.47,30.87 44.43,32.83 arc-45 45.33,33.2 50.67,33.2 arc45 51.57,33.57 TP4.TP arc45 52.34,34.14 v53.4,35.2 arc-45 53.06,35.34 49.57,38.83 arc45 48.67,39.2 46.93,39.2 arc45 46.03,38.83 44.68,37.48 arc-45 v44,37.2 | IC3.89 32.7,32.77 arc-45 33.07,33.67 33.83,34.43 arc45 34.2,35.33 34.2,36.47 arc-45 34.57,37.37 36.03,38.83 arc-45 36.93,39.2 43.07,39.2 arc45 43.97,39.57 v44.2,39.8 | v55,35.6 55.43,35.17 arc45 56.33,34.8 58.77,34.8 arc45 59.67,35.17 59.7,35.2 arc-45 60.3,35.45 J2.37
GND  (via drill 0.3)
  Top 0.2: v22.4,42 22.4,41.6
  Top 1.27: OUTLINE1.GND 114,54.2
  Bottom 0.2: C22.1 41.96,25.65 arc-45 41.61,25.79 41.55,25.85 arc45 41.19,26 IC3.10 39.41,26 arc45 38.71,25.71 v38.6,25.6 | IC3.27 37.7,15.9 arc90 38.2,15.4 38.29,15.4 arc-45 38.65,15.25 39.03,14.87 arc-45 C12.1 39.17,14.35 arc45 38.8,13.45 v38.8,13 arc-45 39.35,12.77 C18.1 | 12.8,6.4 12.4,6.8 12.4,8.4 | C15.1 C16.1 45.27,20.27 44.79,19.79 arc-45 44.09,19.5 v43.8,19.5 43.71,19.5 arc-45 43.01,19.79 42.08,20.73 C19.1 41.83,21 IC3.20 39.41,21 arc-45 38.71,21.29 v38.6,21.4 | v67.45,56.7 v67.45,57.5 Q8.4 67.75,58.28 arc90 68,58.53 68,58.85 arc90 67.75,59.1 Q8.EP2 | IC3.99 37.7,33.19 arc45 37.55,33.55 37.47,33.63 arc-45 37.33,33.98 C39.1 C8.1 arc45 37.45,36.05 38.15,36.75 arc-45 38.76,37 arc45 v39,37.1 | IC4.3 32,57.2 | S8.P$2 v76.55,22.7 | J2.43 63.47,32.45 arc-45 63.61,32.39 v63.8,32.2 63.8,30.31 arc-45 63.65,29.95 | U1.GND2 v7.2,26.15 | SG1.P$2 3.1,48.1 v4.2,48.1 | v24.6,5.4 R5.2 | R11.1 32.65,10.65 33.1,11.1 | JP4.5 26.61,52.18 arc45 26.46,52.54 v26.2,52.8 | C23.1 45.99,26.93 arc-45 45.28,27.22 v45,27.5 | U1.GND1 v15.6,38.2 | IC8.7 63.3,23.9 v63,24.2 62.8,24 IC8.6 | C45.1 55.11,30.6 arc-45 54.75,30.75 v54.6,30.9 54.62,30.9 C38.1 | J2.48 63.65,29.95 | 63.65,29.95 63.8,29.8 63.8,29.4 | 63.8,29.4 63.8,29.15 arc-90 63.6,28.95 J2.50 62.3,29 61.5,29 arc90 61,28.5 C36.2 | J2.49 63.75,29.45 63.8,29.4 | IC9.12 56.84,22.75 arc-45 57.2,22.6 v57.4,22.4 | IC9.3 55.35,21.7 arc90 55.55,21.5 55.85,21.5 | IC9.2 55.85,21.5 | 55.85,21.5 55.85,20.95 v56,20.8 | IC8.1 61.2,21.25 arc90 61,21.05 v61,20.3 | v50.9,19.2 50.98,19.12 C41.2 C42.2 C40.2 55.83,19.12 v55.9,19.2 | C35.2 66.08,23.18 v66,23.1
  Bottom 0.2: 63.8,29.4 v63.85,29.45 | v50.4,50.2 50.5,50.2 | C13.1 32.88,11.53 arc45 33.02,11.18 33.1,11.1 | 33.1,11.1 v33.6,10.6 | R4.2 v68.8,19.6 | C24.1 v52.5,26.6 52.6,26.6 53.3,27.3 C33.1 | C2.1 10.28,14.21 arc-45 v10.6,15.4 | U1.GND3 7.3,40.4 v9,40.4 | v55.8,52.9 R50.2 | S1.P$2 v22.4,42 | R28.2 53.8,47.2 v52.8,47.2 | S5.2 v61.05,57.75 | C11.1 23.23,17.02 arc-45 23.37,17.37 v23.6,17.6 | v49,46.9 49,48 R16.2 | IC4.7 38,57.7 arc90 38.5,58.2 38.5,58.29 arc45 38.35,58.65 37.75,59.25 v37,59.25 | R22.2 51.8,49 v52.8,49 | 53.15,51.3 Q4.4 | R15.2 arc-90 39.8,48.12 v39.8,47 | R33.1 v30.4,41.7
  Bottom 0.406: v50.4,50.2 v49.6,50.2 | v49.6,50.2 R32.1 49.6,51.35 v48.4,51.35 v48.4,50.6 48.65,50.35 arc45 49.01,50.2 v49.6,50.2 | 53.15,51.3 v54.3,51.3 | C29.1 20.3,35.6 v20.2,35.7
  Bottom 0.61: v54.3,52.1 v54.3,51.3 v55.2,51.3
  Bottom 0.813: C3.1 v41.4,60.35 | R13.2 v39.6,60.35
  Bottom 1.016: SV2.1 5.77,17.5 arc45 6.67,17.87 7.63,18.83 arc45 8,19.73 8,21.07 arc-45 8.37,21.97 v9.2,22.8 v10,22.8
  other vias: 37.6,53.8 29.4,53.8 61,51 23,30 11.4,8.4 11.4,11.2 13,13 13,14.8 12.6,18.8 15.4,14.6 18,8.8 18,6.8 29.9,53.2 36.1,48.2 37.5,46.2 37.5,47.2 24.4,11.7 82.8,12.5 84,12.5 85.2,12.5 86.2,12.5 87.2,12.5 25.8,11.7 113.4,8.4 115,8.4 116,11 116.4,26.4 104.72,21.1 109.6,28.4 113.2,28.4 116.4,24.4 116.4,22.4 116.4,18 116.4,13.6 21.6,30 20.2,29.6 14,27.6 14,26 14.4,41.6 14.6,17.8 13.6,16.8 17,18.2 17,20 12.6,19.9 12.6,8.2 37.6,52.5 116.4,28.4 16.6,16 111.8,8 111.4,5.2 111.8,4 111.2,0.8 109.4,7.4 35.8,59.25 34.6,59.25 33.4,59.25 61,45.95 32.8,52.8 34.6,52.8 34.8,58.4 35.6,58.4 35.6,56.2 34.8,56.2 34,60.05 35.2,60.05 36.4,60.05 109.4,2.7 107.8,8 21.2,0.8 107.72,21.1 101.72,21.1 98.22,21.1 95.2,27.6 101.72,18.1 98.72,18.1 98.72,15.1 101.72,15.1 104.72,15.1 107.72,15.1 107.72,18.1 107.72,24.1 104.72,24.1 98.72,23.2 107.72,12.1 110.72,12.1 110.72,15.1 110.72,18.1 110.72,21.1 110.72,24.1 96.4,12.1 96.5,24 61,42.25 109.4,4.4 111.9,2.3 9.2,1.2 15.4,12.8 28.19,59 104.72,12.1 101.72,12.1 98.72,12.1
  pour Bottom (isolate 0.254): 21.1,7.6 21.1,7.8 18.9,10 18.9,23.9 21.2,26.2 25.4,26.2 26.1,26.9 26.1,30.3 25.3,31.1 15.1,31.1 11.6,27.6 11.6,12.8 9.9,10.9 9.9,7.5 8.7,6.3 8.7,-0.4 21.3,-0.6
  pour Bottom (isolate 0.254): 82,14 88.4,14 88.4,9.2 88,8.8 80.4,8.8 80,9.2 80,11.6 80.4,12
  pour Bottom (isolate 0.254): 94.4,30.8 119.6,30.8 119.6,9 arc-90 110.6,0 109,0 109,7.6 92.8,7.6 90,10.4 90,27.6
  pour Top (isolate 0.254): 109,0 110.6,0 arc90 119.6,9 119.6,53 arc25 80,63.2 39.6,63.2 arc25 0,53 0,9 arc90 9,0 86,0 86,7.6 109,7.6
  pour Bottom (isolate 0.254): 23.2,13.6 26.4,13.6 26.8,13.2 26.8,11.6 27.2,11.2 27.2,9.6 26,8.4 25.6,8.4 22.8,11.2 22.8,13.2
  pour Bottom (isolate 0.254): 27.6,55.6 38.4,55.6 39.2,56.4 39.2,60.4 38.4,61.2 27.6,61.2
  pour Bottom (isolate 0.254): 28.8,55.2 38,55.2 38.4,54.8 38.4,45.2 38.8,44.8 32.4,44.8 30.2,47 30.2,51 27.6,53.2 27.6,54
  pour Bottom: 62,51.7 60.9,51.7 arc90 60.4,51.2 60.4,42.2 arc90 60.9,41.7 62,41.7
I2C_SCL  (via drill 0.3)
  Top 0.2: JP2.4 47.58,8.49 arc45 47.21,9.39 45.6,11 v45.6,11.6 | OUTLINE1.SCL 22,61.42 arc-45 21.56,60.36 20.04,58.84 arc-45 18.98,58.4 16.82,58.4 arc45 15.76,57.96 14.57,56.77 arc45 14.2,55.87 v14.2,55.6 | v3.2,41.6 2.95,41.85 arc45 2.59,42 2.2,42 arc90 1.2,41 1.2,11.4 arc90 2.2,10.4 2.59,10.4 arc-45 2.95,10.25 4.85,8.35 arc45 5.21,8.2 6.59,8.2 arc-45 6.95,8.05 8.11,6.89 arc-45 8.4,6.19 8.4,5 arc90 11.4,2 22.8,2 v23,1.8
  Bottom 0.2: IC3.95 35.7,31.55 arc90 36.45,30.8 36.75,30.8 arc-90 38,29.55 38,27.01 arc-45 37.85,26.65 37.55,26.35 arc45 37.4,25.99 37.4,21.21 arc45 37.69,20.51 37.71,20.49 arc-45 38,19.79 38,18.61 arc45 38.15,18.25 38.65,17.75 arc-45 38.8,17.39 38.8,17.18 arc90 39.58,16.4 39.99,16.4 arc-45 40.35,16.25 44.85,11.75 arc45 45.21,11.6 v45.6,11.6 | v14.2,55.6 14.2,53.38 arc-45 13.83,52.48 11.47,50.12 arc45 11.1,49.22 11.1,48.83 arc-45 10.73,47.93 4.89,42.09 arc-45 4.19,41.8 3.4,41.8 v3.2,41.6 | 47.6,3.18 JP2.4 45.95,1.57 arc-45 45.05,1.2 29.08,1.2 arc-45 28.6,1.4 28.37,1.63 arc45 27.47,2 27.13,2 arc45 26.23,1.63 26.17,1.57 arc-45 25.27,1.2 24.13,1.2 arc-45 23.23,1.57 v23,1.8
I2C_SDA  (via drill 0.3)
  Top 0.2: v46.8,11.4 46.8,10.8 arc45 47.08,10.12 47.63,9.57 arc-45 48,8.67 48,5.85 arc45 48.37,4.95 JP2.3 | OUTLINE1.SDA 15.84,59.26 arc-45 15.4,58.2 v12.8,55.6 | v3,42.8 2.75,42.55 arc-45 2.39,42.4 2.05,42.4 arc90 0.8,41.15 0.8,11.25 arc90 2.05,10 2.39,10 arc-45 2.75,9.85 4.65,7.95 arc45 5.01,7.8 6.39,7.8 arc-45 6.75,7.65 7.71,6.69 arc-45 8,5.99 8,4.85 arc90 11.25,1.6 21.79,1.6 arc-45 22.15,1.45 22.45,1.15 arc45 22.81,1 v27.2,1
  Bottom 0.2: IC3.96 36.2,31.4 arc90 36.4,31.2 36.9,31.2 arc-90 38.4,29.7 38.4,26.81 arc-45 38.25,26.45 37.95,26.15 arc45 37.8,25.79 37.8,21.41 arc45 38.09,20.71 38.11,20.69 arc-45 38.4,19.99 38.4,18.81 arc45 38.55,18.45 39.05,17.95 arc-45 39.2,17.59 39.2,17.3 arc90 39.7,16.8 40.19,16.8 arc-45 40.55,16.65 44.65,12.55 arc45 45.01,12.4 45.89,12.4 arc-45 46.25,12.25 46.8,11.7 v46.8,11.4 | v3,42.8 3.2,42.6 4.39,42.6 arc45 5.09,42.89 10.33,48.13 arc45 10.7,49.03 10.7,49.42 arc-45 11.07,50.32 13.43,52.68 arc45 13.8,53.58 13.8,54.07 arc45 13.43,54.97 v12.8,55.6 | v27.2,1 27.4,0.8 47.19,0.8 arc45 48.09,1.17 JP2.3 50,3.08
IMU_IRQ2  (via drill 0.3)
  Top 0.2: v55.8,28.4 58.6,25.6 v58.8,25.6
  Bottom 0.2: IC3.7 42.17,27.5 arc45 43.07,27.87 44.63,29.43 arc-45 45.53,29.8 51.79,29.8 arc-45 52.15,29.65 52.26,29.54 arc-45 52.4,29.2 arc45 52.54,28.86 52.6,28.8 arc45 53.08,28.6 54.8,28.6 55,28.4 v55.8,28.4 | IC8.4 61.1,22.75 arc-90 60.6,23.25 60.6,24.9 arc90 60.1,25.4 59,25.4 v58.8,25.6
IMU_SCL  (via drill 0.3)
  Top 0.2: v49.8,24 v49.8,20.4
  Bottom 0.2: IC3.15 40.64,23.5 arc45 40.74,23.54 arc-45 40.88,23.6 49.19,23.6 arc45 49.55,23.75 v49.8,24 | IC8.13 62.8,19.1 | 62.8,19.1 62.8,19 61.75,17.95 arc-45 61.39,17.8 57.6,17.8 | 57.6,17.8 50.8,17.8 arc-90 49.8,18.8 v49.8,20.4 | R19.2 62.8,19.1 | TP19.TP 57.4,17.6 57.6,17.8
IMU_SDA  (via drill 0.3)
  Top 0.2: v50.8,23.6 v50.8,21.2
  Bottom 0.2: IC3.16 40.72,23 arc45 40.86,23.06 40.94,23.14 arc-45 41.08,23.2 50.19,23.2 arc45 50.55,23.35 v50.8,23.6 | IC8.14 62.3,20.03 arc-45 62.15,19.68 R18.2 61.58,18.68 61.25,18.35 arc-45 60.89,18.2 57.2,18.2 | v50.8,21.2 50.8,20.41 arc-45 50.65,20.05 50.3,19.7 arc45 50.15,19.34 50.15,18.95 arc90 50.9,18.2 57.2,18.2 | TP18.TP 57.4,18.4 57.2,18.2
JOY_DOWN  (via drill 0.3)
  Top 0.2: v85.4,14.6 85.6,14.8 85.6,17.87 arc-45 85.97,18.77 86.13,18.93 arc-45 87.03,19.3 88.23,19.3 arc45 89.12,19.67 89.43,19.98 arc45 89.8,20.88 | SW1.D 96.35,33.45 arc45 96,33.6 93.81,33.6 arc45 93.11,33.31 91.49,31.69 arc-45 90.79,31.4 arc90 89.8,30.41 89.8,20.88 | 89.8,20.87 89.8,20.88
  Bottom 0.15: v85.4,14.6 85.29,14.49 arc-45 84.59,14.2 81.69,14.2 arc45 80.75,13.75
  Bottom 0.2: 80.75,13.75 76.97,9.97 arc-45 76.07,9.6 75.33,9.6 arc45 74.43,9.23 70.57,5.37 arc-45 69.67,5 27.13,5 arc-45 26.23,5.37 20.57,11.03 arc-45 20.2,11.93 20.2,17.87 arc-45 20.57,18.77 22.43,20.63 arc-45 23.33,21 IC3.56
JOY_LEFT  (via drill 0.3)
  Top 0.2: v33,35.8 v33,38.6 | v90.4,56.2 90.55,56.35 arc45 90.7,56.71 90.7,57.29 arc45 90.55,57.65 90.05,58.15 arc-45 89.9,58.51 89.9,59.15 arc90 88.15,60.9 87.85,60.9 arc90 86.1,59.15 86.1,58.7 arc-90 85.6,58.2 84.21,58.2 arc-45 83.51,58.49 v83.2,58.8 | SW1.C 102.41,27.39 arc-90 102.41,28.81 103.63,30.03 arc45 104,30.93 104,31.8 arc90 101.8,34 98.29,34 arc-45 97.8,34.2 97.61,34.4 arc45 97.11,34.6 93.61,34.6 arc45 92.91,34.31 92.29,33.69 arc-45 91.59,33.4 v90.3,33.4 | v38.4,42.4 38.4,43.99 arc-45 38.69,44.69 v39.8,45.8
  Bottom 0.2: v33,35.8 33,35.21 arc-45 32.71,34.51 32.07,33.87 arc45 31.7,32.97 IC3.87 | v33,38.6 32.49,38.09 arc-45 31.79,37.8 30.48,37.8 arc-45 30.34,37.86 30.26,37.94 arc45 30.12,38 29.85,38 arc-90 29.4,38.45 29.4,41.8 arc-90 30.4,42.8 37.79,42.8 arc-45 38.15,42.65 v38.4,42.4 | v90.3,33.4 90.12,33.58 arc-45 90,33.87 90,55.59 arc-45 90.15,55.95 v90.4,56.2 | v83.2,58.8 82.89,58.49 arc-45 82.19,58.2 78.81,58.2 arc-45 78.11,58.49 75.37,61.23 arc45 74.48,61.6 70.41,61.6 arc-45 70.05,61.75 69.95,61.85 arc45 69.59,62 65.55,62 arc90 64.8,61.25 64.8,58.3 arc-90 64.3,57.8 62.61,57.8 arc45 61.91,57.51 61.69,57.29 arc-45 60.99,57 arc-45 60.5,57.2 60.19,57.51 arc45 59.49,57.8 57.85,57.8 arc90 56.6,56.55 56.6,55.28 arc45 56.66,55.14 56.74,55.06 arc-45 56.8,54.92 56.8,49.2 arc-90 56.4,48.8 56,48.8 arc90 55.6,48.4 55.6,47.01 arc-45 55.31,46.31 54.69,45.69 arc-45 53.99,45.4 40.41,45.4 arc-45 40.05,45.55 v39.8,45.8
JOY_RIGHT  (via drill 0.3)
  Top 0.2: v86.6,14.3 86.6,14.8 85.95,15.45 85.95,17.62 arc-45 86.32,18.52 86.33,18.53 arc-45 87.23,18.9 88.37,18.9 arc45 89.27,19.27 89.83,19.83 arc45 90.2,20.73 90.2,27.67 arc-45 90.57,28.57 91.23,29.23 arc45 91.5,29.89 arc-45 91.79,30.59 92.81,31.61 arc-45 93.51,31.9 93.88,31.9 arc-45 94.59,31.61 SW1.B
  Bottom 0.15: 86.4,14.1 arc-45 85.78,13.9 82.03,13.9 arc45 81.03,13.43
  Bottom 0.2: 86.4,14.1 v86.6,14.3 | 81.03,13.43 77.17,9.57 arc-45 76.27,9.2 75.53,9.2 arc45 74.63,8.83 70.77,4.97 arc-45 69.87,4.6 26.93,4.6 arc-45 26.03,4.97 20.17,10.83 arc-45 19.8,11.73 19.8,18.07 arc-45 20.17,18.97 22.33,21.13 arc-45 23.23,21.5 IC3.57
JOY_UP  (via drill 0.3)
  Top 0.2: v87.8,14.4 87.6,14.4 86.4,15.6 86.4,17.72 arc-45 86.6,18.2 86.53,18.13 arc-45 87.43,18.5 88.57,18.5 arc45 89.47,18.87 90.23,19.63 arc45 90.6,20.53 90.6,27.27 arc-45 90.97,28.17 91.23,28.43 arc-45 92.13,28.8 95.19,28.8 arc45 95.89,29.09 98.31,31.51 arc-45 99.01,31.8 99.79,31.8 arc-45 100.49,31.51 101.19,30.81 arc-90 101.19,29.39 99.99,28.19 arc45 99.7,27.49 99.7,26.91 arc45 99.99,26.2 SW1.A
  Bottom 0.15: v87.8,14.4 arc45 87.08,15.3 82.23,15.3 arc45 81.33,14.93 81.23,14.83
  Bottom 0.2: 81.23,14.83 76.77,10.37 arc-45 75.87,10 75.13,10 arc45 74.23,9.63 70.37,5.77 arc-45 69.47,5.4 27.33,5.4 arc-45 26.43,5.77 20.97,11.23 arc-45 20.6,12.13 20.6,17.67 arc-45 20.97,18.57 22.53,20.13 arc-45 23.43,20.5 IC3.55
LCD0  (via drill 0.3)
  Top 0.2: v32,30.2 32.4,30.2 33.25,31.05 arc-45 33.61,31.2 33.99,31.2 arc45 34.35,31.35 34.45,31.45 arc-45 34.81,31.6 35.99,31.6 arc45 36.35,31.75 39.85,35.25 arc-45 40.21,35.4 40.79,35.4 arc45 41.15,35.55 v41.2,35.6 | v47.2,38.4 47.2,38.6 arc-90 48.2,39.6 48.87,39.6 arc45 49.77,39.97 51.12,41.32 arc-45 51.8,41.6 52.07,41.6 arc-45 52.97,41.23 53.63,40.57 arc45 54.53,40.2 55.87,40.2 arc-45 56.77,39.83 57.71,38.89 arc45 58.41,38.6 v59,38.6
  Bottom 0.2: J2.32 61.46,37.95 arc-45 61.1,38.1 60.6,38.6 TP1.TP v59,38.6 | v32,30.2 32,29.01 arc-45 31.85,28.65 31.75,28.55 arc45 31.6,28.19 31.6,27.61 arc-45 31.45,27.25 27.97,23.77 arc-45 27.08,23.4 25.2,23.4 25.1,23.5 IC3.61 | v41.2,35.6 41.23,35.63 arc-45 42.13,36 44,36 arc57 46.2,37.2 47.06,38.06 arc45 v47.2,38.4
LCD1  (via drill 0.3)
  Top 0.2: v40.4,34.6 40.01,34.6 arc45 39.65,34.45 36.62,31.42 arc-45 36.09,31.2 35.01,31.2 arc45 34.65,31.05 34.55,30.95 arc-45 34.19,30.8 33.81,30.8 arc45 33.45,30.65 32.86,30.06 arc45 32.8,29.92 32.8,29.78 arc-45 32.74,29.64 32.45,29.35 arc-45 32.09,29.2 v31.2,29.2 | v48,37.4 48,38.52 arc-45 48.2,39 arc-45 48.68,39.2 49.07,39.2 arc45 49.97,39.57 51.32,40.92 arc-45 52,41.2 arc-45 52.68,40.92 53.43,40.17 arc45 54.33,39.8 55.4,39.8 arc-90 v56,39.2
  Bottom 0.2: v40.4,34.6 40.6,34.8 42.27,34.8 arc45 43.17,35.17 43.23,35.23 arc-45 44.13,35.6 44.2,35.6 arc48 46,36.4 46.63,37.03 arc-45 47.53,37.4 v48,37.4 | v31.2,29.2 31.2,27.81 arc-45 31.05,27.45 27.69,24.09 arc-45 26.99,23.8 25.4,23.8 25.2,24 IC3.62 | J2.31 61.7,38.45 arc-90 61.2,38.95 61.2,39.1 arc90 60.7,39.6 56.61,39.6 arc45 56.25,39.45 v56,39.2
LCD2  (via drill 0.3)
  Top 0.2: v29.4,36.4 29.4,38.19 arc-45 29.69,38.89 v30.6,39.8 | v60,43 60.71,43.71 arc-45 61.41,44 v64.8,44
  Bottom 0.2: v64.8,44 64.09,43.29 arc45 63.8,42.59 63.8,39.68 arc-45 63.6,39.2 arc-45 62.6,38.95 J2.30 | v30.6,39.8 30.63,39.77 arc45 31.53,39.4 33.67,39.4 arc45 34.57,39.77 35.23,40.43 arc-45 36.13,40.8 41.12,40.8 arc45 41.6,41 41.83,41.23 arc-45 42.73,41.6 59,41.6 arc90 60,42.6 v60,43 | v29.4,36.4 28.95,35.95 arc45 28.8,35.59 28.8,33.2 28.7,33.1 IC3.81
LCD3  (via drill 0.3)
  Top 0.2: v29.6,35 30.05,35.45 arc45 30.2,35.81 30.2,38.1 arc-90 30.7,38.6 v30.8,38.6 | v59.6,44.2 59.68,44.28 arc-45 59.97,44.4 63.19,44.4 arc45 63.55,44.55 v63.8,44.8
  Bottom 0.2: v63.8,44.8 63.55,44.55 arc45 63.4,44.19 63.4,39.8 arc-90 63.05,39.45 J2.29 | v30.8,38.6 30.3,38.6 arc-90 29.8,39.1 29.8,39.92 arc-45 30,40.4 arc-45 30.48,40.6 30.8,40.6 arc-45 31.14,40.46 31.43,40.17 arc45 32.33,39.8 33.47,39.8 arc45 34.37,40.17 35.03,40.83 arc-45 35.93,41.2 40.67,41.2 arc45 41.57,41.57 41.63,41.63 arc-45 42.53,42 57.7,42 arc90 59.2,43.5 59.2,43.8 arc-90 v59.6,44.2 | v29.6,35 29.35,34.75 arc45 29.2,34.39 IC3.82
LCD4  (via drill 0.3)